# Altium schematic sheet CU_DP.SchDoc
size A
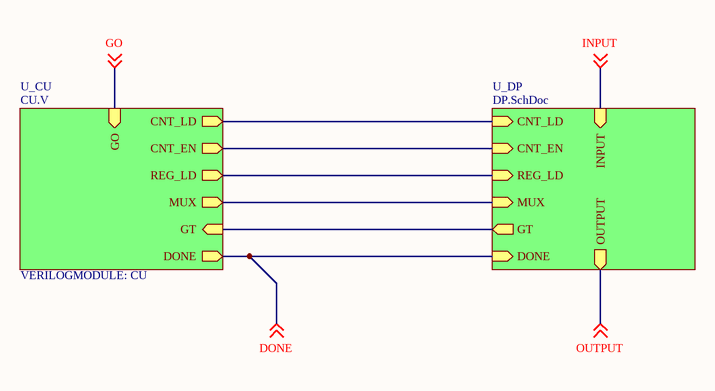
[diagram p0: CU_DP.SchDoc]

## Sub-sheets
U_CU = CU.V: CNT_EN (out), CNT_LD (out), DONE (out), GO (in), GT (in), MUX (out), REG_LD (out)  | VERILOGMODULE: CU
U_DP = DP.SchDoc: OUTPUT (out), CNT_LD (in), CNT_EN (in), REG_LD (in), MUX (in), INPUT (in), DONE (in), GT (out)

## Nets
DONE: off-sheet DONE, sheet U_DP/DONE, sheet U_CU/DONE
GO: off-sheet GO, sheet U_CU/GO
INPUT: off-sheet INPUT, sheet U_DP/INPUT
OUTPUT: off-sheet OUTPUT, sheet U_DP/OUTPUT
(unnamed): sheet U_DP/CNT_LD, sheet U_CU/CNT_LD
(unnamed): sheet U_DP/CNT_EN, sheet U_CU/CNT_EN
(unnamed): sheet U_DP/REG_LD, sheet U_CU/REG_LD
(unnamed): sheet U_DP/MUX, sheet U_CU/MUX
(unnamed): sheet U_DP/GT, sheet U_CU/GT